# EAGLE schematic blank_card (EAGLE 9.6.2)
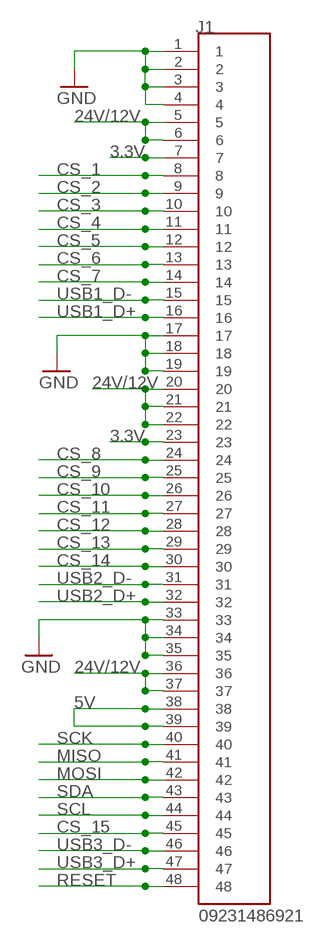
[diagram p0: schematic, sheet 1]

## Parts
J1  09231486921  [HARTING_09231486921]

## Nets
3.3V: J1.7 J1.23
5V: J1.38 J1.39
24V/12V [POWER]: J1.5 J1.6 J1.20 J1.21 J1.22 J1.36 J1.37
CS_1: J1.8
CS_2: J1.9
CS_3: J1.10
CS_4: J1.11
CS_5: J1.12
CS_6: J1.13
CS_7: J1.14
CS_8: J1.24
CS_9: J1.25
CS_10: J1.26
CS_11: J1.27
CS_12: J1.28
CS_13: J1.29
CS_14: J1.30
CS_15: J1.45
GND: J1.1 J1.2 J1.3 J1.4 J1.17 J1.18 J1.19 J1.33 J1.34 J1.35
MISO: J1.41
MOSI: J1.42
RESET: J1.48
SCK: J1.40
SCL: J1.44
SDA: J1.43
USB1_D+: J1.16
USB1_D-: J1.15
USB2_D+: J1.32
USB2_D-: J1.31
USB3_D+: J1.47
USB3_D-: J1.46

## Library data of the parts
J1 = din41612_48_pin_board:09231486921: Check prices <https://pricing.snapeda.com/parts/8-1393644-0/TE%20Connectivity/view-part?ref=eda>; AVAILABILITY: In Stock; COMMENT: 09231486921; DESCRIPTION: Conn DIN 41612 M 48 POS 2.54mm Solder RA Thru-Hole Tray; EU_ROHS_COMPLIANCE: Compliant; MF: HARTING; MP: 09231486921; PACKAGE: None; PRICE: 6$; PURCHASE-URL-DIGIKEY: https://www.digikey.ca/en/products/detail/harting/09231486921/3180439

## Net classes
1 POWER: clearance 0.508 mm